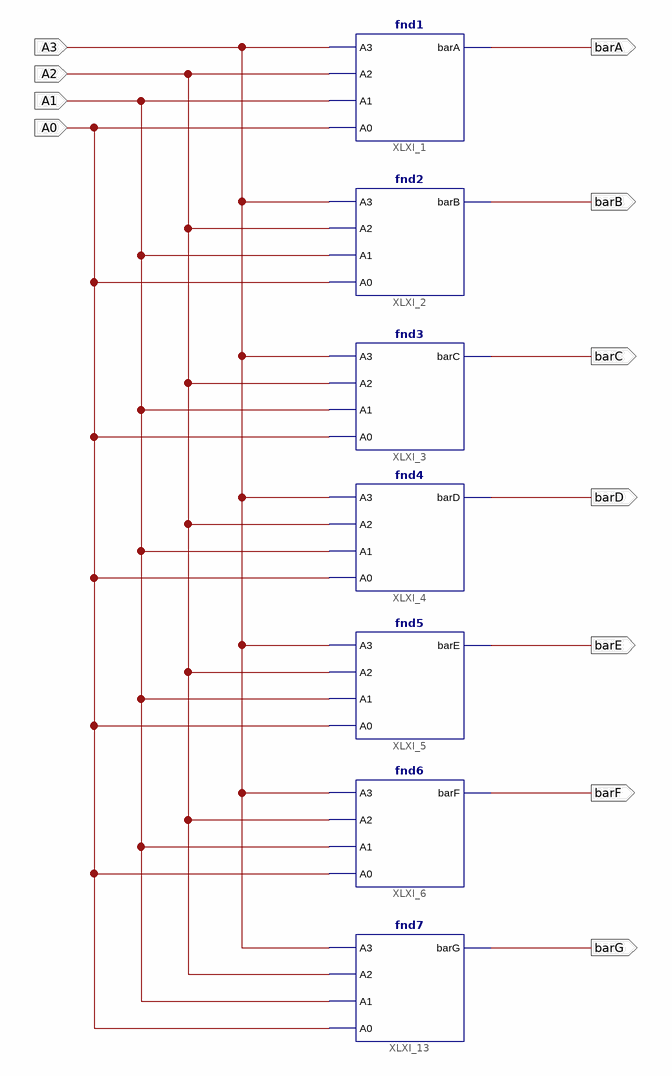
[diagram p0: schematic sheet 1]
// Xilinx ISE schematic fnd0.sch (spartan6) as structural Verilog: 7 symbols, 11 ports
module fnd0 (
  input  A3,
  input  A2,
  input  A1,
  input  A0,
  output barA,
  output barB,
  output barC,
  output barD,
  output barE,
  output barF,
  output barG
);

  fnd1 XLXI_1 (.A0(A0), .A1(A1), .A2(A2), .A3(A3), .barA(barA));
  fnd2 XLXI_2 (.A0(A0), .A1(A1), .A2(A2), .A3(A3), .barB(barB));
  fnd3 XLXI_3 (.A0(A0), .A1(A1), .A2(A2), .A3(A3), .barC(barC));
  fnd4 XLXI_4 (.A0(A0), .A1(A1), .A2(A2), .A3(A3), .barD(barD));
  fnd5 XLXI_5 (.A0(A0), .A1(A1), .A2(A2), .A3(A3), .barE(barE));
  fnd6 XLXI_6 (.A0(A0), .A1(A1), .A2(A2), .A3(A3), .barF(barF));
  fnd7 XLXI_13 (.A0(A0), .A1(A1), .A2(A2), .A3(A3), .barG(barG));
endmodule
